# EAGLE design NodeRelay.v1.cg2 (EAGLE 4.16)
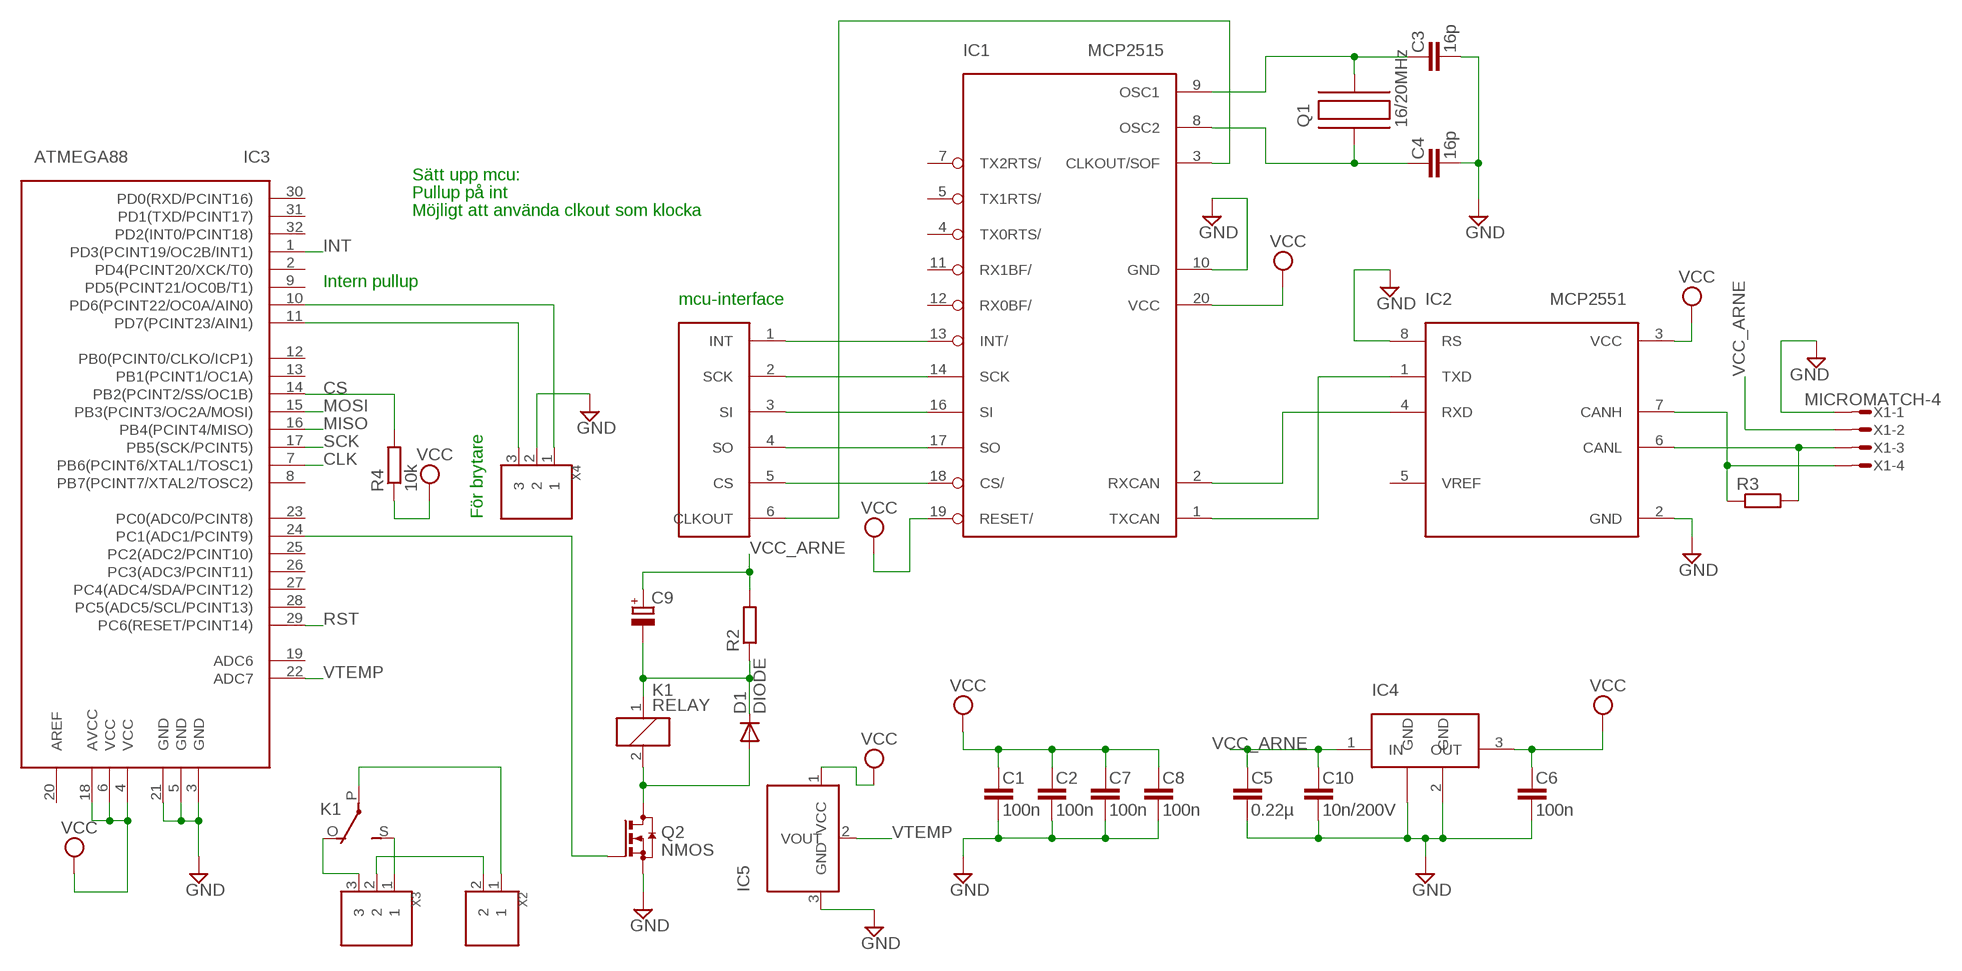
[diagram p0: schematic, sheet 1]

## Parts
C1  100n  C-EU  [C0603]
C2  100n  C-EU  [C0603]
C3  16p  C-EU  [C0603]
C4  16p  C-EU  [C0603]
C5  0.22µ  C-EU  [C0603]
C6  100n  C-EU  [C0603]
C7  100n  C-EU  [C0603]
C8  100n  C-EU  [C0603]
C9  CPOL-EU  [153CLV-0807]
C10  10n/200V  C-EU  [C0603]
D1  DIODE  [SOT23]
IC1  MCP2515  [TSSOP]
IC2  MCP2551  [SOIC]
IC3  ATMEGA88  [TQFP32]
IC4  LM340MP-5.0  [SOT223]
IC5  TC1047A  [SOT23]
K1  RELAY  [TYCO-PCH]
Q1  16/20MHz  C-MAC-LFA147E  [SMD]
Q2  NMOS  [SOT23]
R2  R-EU_R0805  [R0805@1]
R3  R-EUR0603  [R0603]
R4  10k  R-EUR0603  [R0603]
U$1  CAN-INTERFACE  [VIA-LIST]
X1  MICROMATCH-4  [MICROMATCH-4]
X2  BLOCK2  [PCB2]
X3  BLOCK3  [PCB3]
X4  BLOCK3  [PCB3]

## Nets
CANH: IC2.7(CANH) R3.1 X1.4
CLK: IC1.3(CLKOUT/SOF) IC3.7(PB6(PCINT6/XTAL1/TOSC1)) U$1.6(CLKOUT)
CS: IC1.18(CS/) IC3.14(PB2(PCINT2/SS/OC1B)) R4.2 U$1.5(CS)
GND: C1.2 C2.2 C3.2 C4.2 C5.2 C6.2 C7.2 C8.2 C10.2 IC1.10(GND) IC2.2(GND) IC2.8(RS) IC3.3(GND) IC3.5(GND) IC3.21(GND) IC4.2(GND) IC4.4(GND) IC5.3(GND) Q2.2(S) X1.1 X4.2
INT: IC1.13(INT/) IC3.1(PD3(PCINT19/OC2B/INT1)) U$1.1(INT)
MISO: IC1.17(SO) IC3.16(PB4(PCINT4/MISO)) U$1.4(SO)
MOSI: IC1.16(SI) IC3.15(PB3(PCINT3/OC2A/MOSI)) U$1.3(SI)
N$1: IC1.2(RXCAN) IC2.4(RXD)
N$2: IC1.1(TXCAN) IC2.1(TXD)
N$3: X2.2 X3.2
N$5: K1.P(2:P) X2.1
N$6: K1.S(2:S) X3.1
N$7: K1.O(2:O) X3.3
N$8: C9.- D1.3(C) K1.1 R2.1
N$9: D1.1(A) K1.2 Q2.3(D)
N$11: IC3.11(PD7(PCINT23/AIN1)) X4.3
N$12: C3.1 IC1.9(OSC1) Q1.P$2
N$13: C4.1 IC1.8(OSC2) Q1.P$1
N$14: IC3.24(PC1(ADC1/PCINT9)) Q2.1(G)
N$15: IC3.10(PD6(PCINT22/OC0A/AIN0)) X4.1
N$16: IC2.6(CANL) R3.2 X1.3
RST: IC3.29(PC6(RESET/PCINT14))
SCK: IC1.14(SCK) IC3.17(PB5(SCK/PCINT5)) U$1.2(SCK)
VCC: C1.1 C2.1 C6.1 C7.1 C8.1 IC1.19(RESET/) IC1.20(VCC) IC2.3(VCC) IC3.4(VCC) IC3.6(VCC) IC3.18(AVCC) IC4.3(OUT) IC5.1(VCC) R4.1
VCC_ARNE: C5.1 C9.+ C10.1 IC4.1(IN) R2.2 X1.2
VTEMP: IC3.22(ADC7) IC5.2(VOUT)
Unconnected: IC1.4(TX0RTS/) IC1.5(TX1RTS/) IC1.7(TX2RTS/) IC1.11(RX1BF/) IC1.12(RX0BF/) IC2.5(VREF) IC3.2(PD4(PCINT20/XCK/T0)) IC3.8(PB7(PCINT7/XTAL2/TOSC2)) IC3.9(PD5(PCINT21/OC0B/T1)) IC3.12(PB0(PCINT0/CLKO/ICP1)) IC3.13(PB1(PCINT1/OC1A)) IC3.19(ADC6) IC3.20(AREF) IC3.23(PC0(ADC0/PCINT8)) IC3.25(PC2(ADC2/PCINT10)) IC3.26(PC3(ADC3/PCINT11)) IC3.27(PC4(ADC4/SDA/PCINT12)) IC3.28(PC5(ADC5/SCL/PCINT13)) IC3.30(PD0(RXD/PCINT16)) IC3.31(PD1(TXD/PCINT17)) IC3.32(PD2(INT0/PCINT18))

## Notes on the sheet
- Sätt upp mcu:
- Pullup på int
- Möjligt att använda clkout som klocka
- Intern pullup
- mcu-interface
- För brytare

## Library data of the parts
C1-C8 C10 = rcl:C-EU
C9 = rcl:CPOL-EU
D1 = diode:DIODE: DIODE ultra fast rectifier, 3 A
IC1 = mcp2515:MCP2515
IC2 = mcp2551:MCP2551
IC3 = atmega88:ATMEGA88
IC4 = lm340mp:LM340MP-5.0
IC5 = tc1047a:TC1047A
K1 = relay:RELAY: RELAY 1 x switch, Omron
Q1 = hc49-4h-smx:C-MAC-LFA147E
Q2 = transistor:NMOS
R2 = rcl:R-EU_: RESISTOR, European symbol
R3 R4 = rcl:R-EU
U$1 = can-interface:CAN-INTERFACE
X1 = con-amp-micromatch:MICROMATCH-4: MicroMaTch 4 7-215464-4 / 0-215464-4 Drawing Number C-215464 DDEController.pdf
X2 = terminal_block:BLOCK2
X3 X4 = terminal_block:BLOCK3

## Board
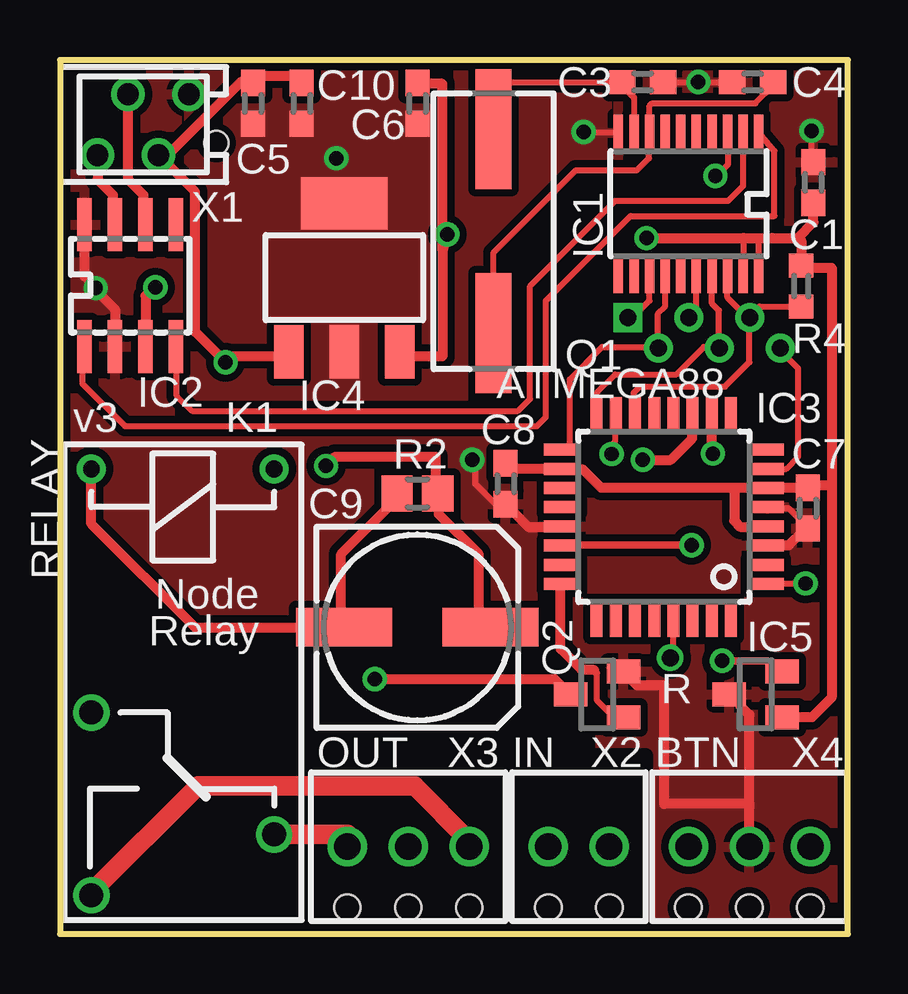
[diagram p1: board, top side]
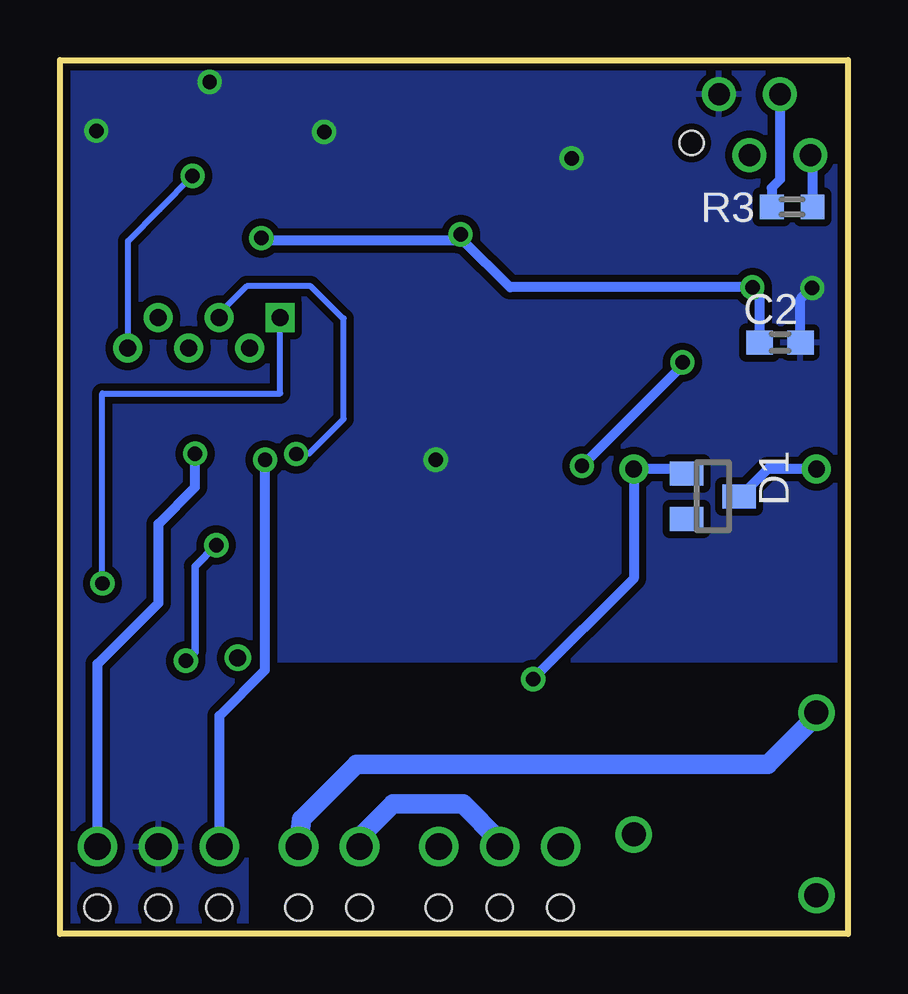
[diagram p2: board, bottom side, seen from below]

Size 32.85 x 36.43 mm. Coordinates in mm from the lower left corner, seen from the top.
Outline: 0,0 32.85,0 32.85,36.43 0,36.43 0,0
Copper layers (1*16): Top 0.035mm / dielectric 1.5mm / Bottom 0.035mm
Design rules "10mils, 0.6drill": minimum track width 10mil, minimum drill 0.6mm, track to track 10mil, track to pad 10mil, pad to pad 10mil, via to via 10mil, smd to smd 10mil, copper to edge 10mil, drill to drill 10mil, minimum pad ring 10mil, minimum via ring 8mil, stop-mask expansion 0mil, vias tented up to drill 0mil, thermal gap 10mil
tRestrict: area 10.5,7.4 to 22,8.8; area 10.5,8.7 to 15.4,10.2; area 10.5,0 to 24.4,7.4; area -0.1,0 to 10.5,11
bRestrict: area -0.1,0 to 24.7,11

### Footprints (pad centres in the part's own frame; a part is rotated, then mirrored left to right if it is on the bottom)
C0603 = smd 1.1 x 1: 1 -0.85,0; 2 0.85,0
153CLV-0807 = smd 4 x 1.6: + 3.05,0; - -3.05,0
SOT23 = smd 1 x 1.4: 1 -0.95,-1.1; 2 0.95,-1.1; 3 0,1.1
TSSOP = smd 0.396 x 1.5: 1 -2.925,-2.975; 2 -2.275,-2.975; 3 -1.625,-2.975; 4 -0.975,-2.975; 5 -0.325,-2.975; 6 0.325,-2.975; 7 0.975,-2.975; 8 1.625,-2.975; 9 2.275,-2.975; 10 2.925,-2.975; 11 2.925,2.975; 12 2.275,2.975; 13 1.625,2.975; 14 0.975,2.975; 15 0.325,2.975; 16 -0.325,2.975; 17 -0.975,2.975; 18 -1.625,2.975; 19 -2.275,2.975; 20 -2.925,2.975
SOIC = smd 0.6 x 2.2: 1 -1.905,-2.54; 2 -0.635,-2.54; 3 0.635,-2.54; 4 1.905,-2.54; 5 1.905,2.54; 6 0.635,2.54; 7 -0.635,2.54; 8 -1.905,2.54
TQFP32 = smd 1.5 x 0.5: 1 -4.25,2.65; 2 -4.25,1.85; 3 -4.25,1.05; 4 -4.25,0.25; 5 -4.25,-0.55; 6 -4.25,-1.35; 7 -4.25,-2.15; 8 -4.25,-2.95; 17 4.25,-2.95; 18 4.25,-2.15; 19 4.25,-1.35; 20 4.25,-0.55; 21 4.25,0.25; 22 4.25,1.05; 23 4.25,1.85; 24 4.25,2.65 | smd 0.5 x 1.5: 9 -2.8,-4.4; 10 -2,-4.4; 11 -1.2,-4.4; 12 -0.4,-4.4; 13 0.4,-4.4; 14 1.2,-4.4; 15 2,-4.4; 16 2.8,-4.4; 25 2.8,4.1; 26 2,4.1; 27 1.2,4.1; 28 0.4,4.1; 29 -0.4,4.1; 30 -1.2,4.1; 31 -2,4.1; 32 -2.8,4.1
SOT223 = smd 1.219 x 2.235: 1 -2.311,-3.099; 2 0,-3.099; 3 2.311,-3.099 | smd 3.6 x 2.2: 4 0,3.099
TYCO-PCH = drill 0.7 round: 1 -8.89,-3.81; 2 -8.89,3.81 | drill 1 round: O 6.35,3.81; P 1.27,-3.81; S 8.89,-3.81
SMD = smd 5 x 1.5: P$1 4.25,0; P$2 -4.25,0
R0805 = smd 1.3 x 1.5: 1 -0.85,0; 2 0.85,0
R0603 = smd 0.991 x 1.016: 1 -0.85,0; 2 0.85,0
VIA-LIST = drill 0.7 square: 1 0,2.54 | drill 0.7 round: 2 -1.27,1.27; 3 0,0; 4 -1.27,-1.27; 5 0,-2.54; 6 -1.27,-3.81
MICROMATCH-4 = drill 0.9 round: 1 1.905,1.27; 2 0.635,-1.27; 3 -0.635,1.27; 4 -1.905,-1.27 | hole 1: 3.048,-0.762
PCB2 = drill 1.1 round: 1 -2.54,0; 2 0,0 | hole 1.1: -2.54,2.54; 0,2.54
PCB3 = drill 1.1 round: 1 -2.54,0; 2 0,0; 3 2.54,0 | hole 1.1: -2.54,2.54; 0,2.54; 2.54,2.54

### Placement (x,y rotation side)
C1  31.41,31.32 90 top
C2  2.83,24.65 0 bottom
C3  24.3,35.51 0 top
C4  28.87,35.51 180 top
C5  8.04,34.62 270 top
C6  14.9,34.62 270 top
C7  31.17,17.75 270 top
C8  18.58,18.76 270 top
C9  14.9,12.78 0 top
C10  10.07,34.62 270 top
D1  5.63,18.24 270 bottom
IC1  26.21,30.43 180 top
IC2  2.93,27.02 0 top
IC3  25.17,17.23 180 top
IC4  11.86,27.35 0 top
IC5  29,9.98 90 top
K1  5.12,10.49 270 top
Q1  18.08,29.29 270 top
Q2  22.39,9.98 90 top
R2  [R0805]  14.9,18.36 0 top
R3  2.33,30.3 180 bottom
R4  30.9,27 270 top
U$1  26.22,25.69 90 top
X1  3.47,33.73 0 top
X2  20.36,3.63 180 top
X3  14.52,3.63 180 top
X4  28.74,3.63 180 top

### Tracks (layer width: path | path; a pad name or v marks a point on that pad's centre or on a via)
CANH
  Top 0.406: IC2.7 2.2,29.68 2.2,30.81 1.57,31.45 X1.4
  Bottom 0.406: X1.4 1.57,32.34 1.48,32.25 R3.1
CLK  (via drill 0.6)
  Top 0.254: v27.32,31.6 27.32,31.55 27.86,32.08 27.86,33.35 27.83,33.38 IC1.3 | IC3.7 30.27,19.38 30.78,19.89 30.78,23.57 30.01,24.33 30.03,24.35 U$1.6
  Bottom 0.254: v27.32,31.6 28.69,30.2 30.01,28.88 30.01,24.43 U$1.6
CS
  Top 0.254: U$1.5 28.7,25.69 28.62,25.73 27.83,26.52 IC1.18 | U$1.5 28.76,25.72 28.74,25.73 29.16,26.15 R4.2 | IC3.14 23.92,21.69 23.92,22.56 24.17,22.81 27.73,22.81 28.74,23.83 28.74,25.68 U$1.5
GND  (via drill 0.6, 0.61)
  Top 0.254: v21.84,33.43 23.28,33.43 IC1.10 | v31.33,33.48 31.33,32.74 C1.2 | IC3.21 21.28,16.97 | C3.2 v26.61,35.51 C4.2 | 29.48,17.73 30.39,17.73 31.03,17.1 | C8.2 18.15,17.91 17.31,18.75 17.31,19.64 v17.19,19.76
  Top 0.406: X4.2 28.74,5.28 | 28.74,5.28 28.74,5.41 25.19,5.41 25.19,10.36 24.04,10.36 23.6,10.81 | 23.54,10.89 23.54,10.87 23.6,10.81 | IC5.3 28.74,9.14 28.74,5.28 | IC2.8 1.03,27.41 1.57,26.87 | v1.49,26.93 1.44,26.87 2.3,26.02 IC2.2 | 29.48,17.73 IC3.5 | 31.03,16.97 31.11,16.97 C7.2 | 31.03,16.97 31.03,17.1 | IC3.3 29.45,16.21 30.39,16.21 31.03,16.84 31.03,16.97 | IC3.21 20.91,16.97 19.53,16.97 C8.2 | 23.6,10.81 Q2.2
  Bottom 0.254: v17.19,19.76 17.06,19.89
  Bottom 0.305: v26.61,35.51 26.31,35.41
  Bottom 0.406: v1.49,26.93 1.52,26.93 1.98,26.46 C2.2
  other vias: 11.52,32.33
  pour Bottom (isolate 0.305): 0.12,36.32 32.83,36.32 32.83,0.1 24.38,0.1 0.12,0.1
  pour Top (isolate 0.305, no thermals): 6.06,35.83 15.89,35.83 15.89,21.38 6.06,21.38
  pour Top (isolate 0.305): 0.17,36.27 32.68,36.27 32.68,0.08 0.17,0.08
INT  (via drill 0.6)
  Top 0.254: 29.94,14.61 v31.08,14.61 | U$1.1 23.7,25.69 23.79,25.6 24.58,26.39 IC1.13
  Top 0.305: IC3.1 29.94,14.61
  Bottom 0.254: v31.08,14.61 31.08,22.53 23.66,22.53 23.66,25.73 23.68,25.72 U$1.1
MISO
  Top 0.254: IC1.17 27.18,26.28 27.47,25.99 27.47,24.46 | 27.47,24.46 27.49,24.45 U$1.4 27.47,24.43 27.47,24.46 | IC3.16 22.39,21.65 22.39,22.56 23.16,23.32 25.7,23.32 26.84,24.46 27.47,24.46
MOSI  (via drill 0.6)
  Top 0.254: U$1.3 26.22,25.72 26.2,25.73 26.53,26.06 IC1.16 | IC3.15 23.16,21.62 23.16,20.52 23.03,20.4 23.03,20.02 23.01,20.02 v23,20
  Bottom 0.254: v23,20 22.47,20.02 21.02,21.46 21.02,25.66 21.05,25.66 22.39,27 25.06,27 26.33,25.73 26.08,25.73 26.12,25.69 U$1.3
N$1
  Top 0.254: IC1.2 28.48,31.18 27.86,30.56 23.16,30.56 19.6,27 19.6,22.3 19.09,21.79 5.5,21.79 4.87,22.43 4.87,24.33 5,24.46 4.97,24.48 IC2.4
N$2
  Top 0.254: IC1.1 29.79,32.63 29.79,29.92 23.79,29.92 20.26,26.39 20.26,21.54 19.88,21.16 2.71,21.16 0.93,22.94 0.93,24.21 1.19,24.46 1.16,24.48 IC2.1
N$3
  Bottom 0.813: X3.2 14.52,3.89 16.04,5.41 18.96,5.41 20.23,4.14 X2.2
N$5
  Bottom 0.813: X2.1 22.77,4.78 20.49,7.06 3.34,7.06 1.31,9.09 K1.P
N$6
  Top 0.813: X3.1 17.06,3.89 14.77,6.17 5.76,6.17 1.31,1.73 K1.S
N$7
  Top 0.813: K1.O 11.98,4.14 X3.3
N$8
  Top 0.406: K1.1 1.31,17.1 5.63,12.78 C9.- 11.73,12.4 11.73,15.82 14.01,18.11 14.01,18.36 R2.1
  Bottom 0.406: D1.3 4.49,18.24 3.34,19.38 K1.1
N$9  (via drill 0.6)
  Top 0.406: v13.12,10.62 20.62,10.62 21.25,9.98 Q2.3
  Bottom 0.406: v13.12,10.62 8.93,14.81 K1.2 6.92,19.38 D1.1
N$11  (via drill 0.6)
  Top 0.406: v24.3,19.76 25.47,19.76 26.36,20.65 26.36,21.52 26.37,21.53 IC3.11
  Bottom 0.406: X4.3 26.2,9.09 24.3,11 v24.3,19.76
N$12
  Top 0.254: 23.28,35.51 C3.1 | IC1.9 23.93,34.86 23.28,35.51 | Q1.P$2 18.08,35.38 18.2,35.51 23.28,35.51
N$13
  Top 0.254: C4.1 29.72,35.42 29.76,35.38 29,34.62 24.68,34.62 24.58,34.52 IC1.8 24.58,33.25 24.55,33.22 24.55,32.34 24.04,31.83 21.5,31.83 18.08,28.4 Q1.P$1
N$14
  Top 0.254: 22.27,11 22.39,10.87 22.39,9.73 23.09,9.03 Q2.1
  Top 0.406: IC3.24 20.87,14.53 20.87,11.89 | 20.87,11.89 20.87,11.86 | 22.27,11 21.76,11 20.87,11.89
N$15  (via drill 0.6)
  Top 0.406: IC3.10 27.17,20.07 v27.22,20.02
  Bottom 0.406: X4.1 31.28,11.25 28.74,13.79 28.74,17.1 27.22,18.62 v27.22,20.02
N$16
  Top 0.406: 3.49,29.67 3.47,29.67 | IC2.6 3.49,29.67 | 3.49,29.67 3.49,30.79 2.84,31.45 X1.3
  Bottom 0.406: R3.2 3.18,31.1 2.84,31.45 X1.3
RST  (via drill 0.7)
  Top 0.254: IC3.29 25.57,13.16 | IC3.29 | v25.44,11.51 25.57,11.51 IC3.29
SCK
  Top 0.254: IC3.17 21.25,20.37 21.25,23.11 22.6,24.46 24.93,24.46 24.93,24.43 U$1.2 24.85,24.42 24.81,24.46 24.93,24.59 24.93,25.86 25.23,26.16 IC1.14
VCC  (via drill 0.6)
  Top 0.254: 29.81,18.59 IC3.6 29.05,18.59 | 21.28,19.36 IC3.18 | IC1.20 29.12,27.58 29.12,29.01 29.68,29.01 | IC1.19 28.48,27.52 28.49,27.51 28.49,29.01 28.49,29.03
  Top 0.406: 15.95,28.53 15.95,24.07 14.08,24.07 14.08,24.51 IC4.3 | 15.95,28.53 15.95,35.44 14.95,35.44 14.9,35.38 C6.1 | v16.15,29.16 15.95,28.53 | v24.45,29.01 28.49,29.01 29.68,29.01 | 29.68,29.01 29.68,29 | 32.17,18.7 31.41,18.7 C7.1 30.95,18.59 29.81,18.59 | 21.28,19.36 21.81,19.36 22.57,18.59 28.11,18.59 | 29.05,18.59 28.11,18.59 | 29.68,29.01 30.78,29.01 30.78,29.03 | 32.17,18.7 32.17,27.76 31.03,27.76 30.9,27.89 | IC5.1 31.35,9.03 32.17,9.86 32.17,18.7 | v3.98,26.95 3.98,27 3.57,26.59 IC2.3 | C1.1 31.41,29.67 30.78,29.03 | 30.9,27.89 30.9,28.91 30.78,29.03 | 30.9,27.89 R4.1 | IC3.4 29.41,16.97 28.36,16.97 28.11,17.22 28.11,18.59 | IC3.18 18.81,19.38 C8.1
  Bottom 0.406: v24.45,29.01 24.4,29.01 24.3,28.91 16.04,28.91 | C2.1 3.68,26.58 3.98,26.87 v3.98,26.95 14.09,26.95 16.04,28.91 | 16.04,28.91 v16.15,29.16
VCC_ARNE  (via drill 0.6)
  Top 0.305: 6.72,24.13 6.8,24.06 9.3,24.06 IC4.1 | C5.1 7.97,35.43
  Top 0.406: 17.44,12.42 C9.+ | 17.44,12.42 17.31,12.43 | 9.3,24.06 9.44,23.95 9.19,24.08 6.9,24.08 v6.9,23.83 5.63,25.1 5.63,30.94 4.49,32.08 4.49,32.46 | v11.09,19.51 11.47,19.89 15.66,19.89 15.66,18.45 R2.2 15.79,18.36 15.79,17.5 17.44,15.85 17.44,12.43 17.44,12.42 | 8.17,35.51 8.17,35.47 C5.1 8.04,35.51 | 8.17,35.51 8.17,35.76 10.07,35.76 C10.1 | 4.49,32.46 X1.2 | 4.49,32.46 7.54,35.51 8.17,35.51
  Bottom 0.406: v11.09,19.51 7.03,23.57 v6.9,23.83
VTEMP  (via drill 0.61)
  Top 0.305: 30.14,10.98 IC5.2 30.07,10.93 30.01,10.87 29.51,11.38 v27.6,11.38 | 20.9,16.21 20.87,16.21 | IC3.22 20.9,16.21 | 20.9,16.21 v26.33,16.21
  Bottom 0.305: v26.33,16.21 27.22,15.32 27.22,11.76 v27.6,11.38

### Text on the board
tPlace: v3 | Node | Relay | R | OUT | IN | BTN